# EAGLE design alpha_board (EAGLE 7.4.0)
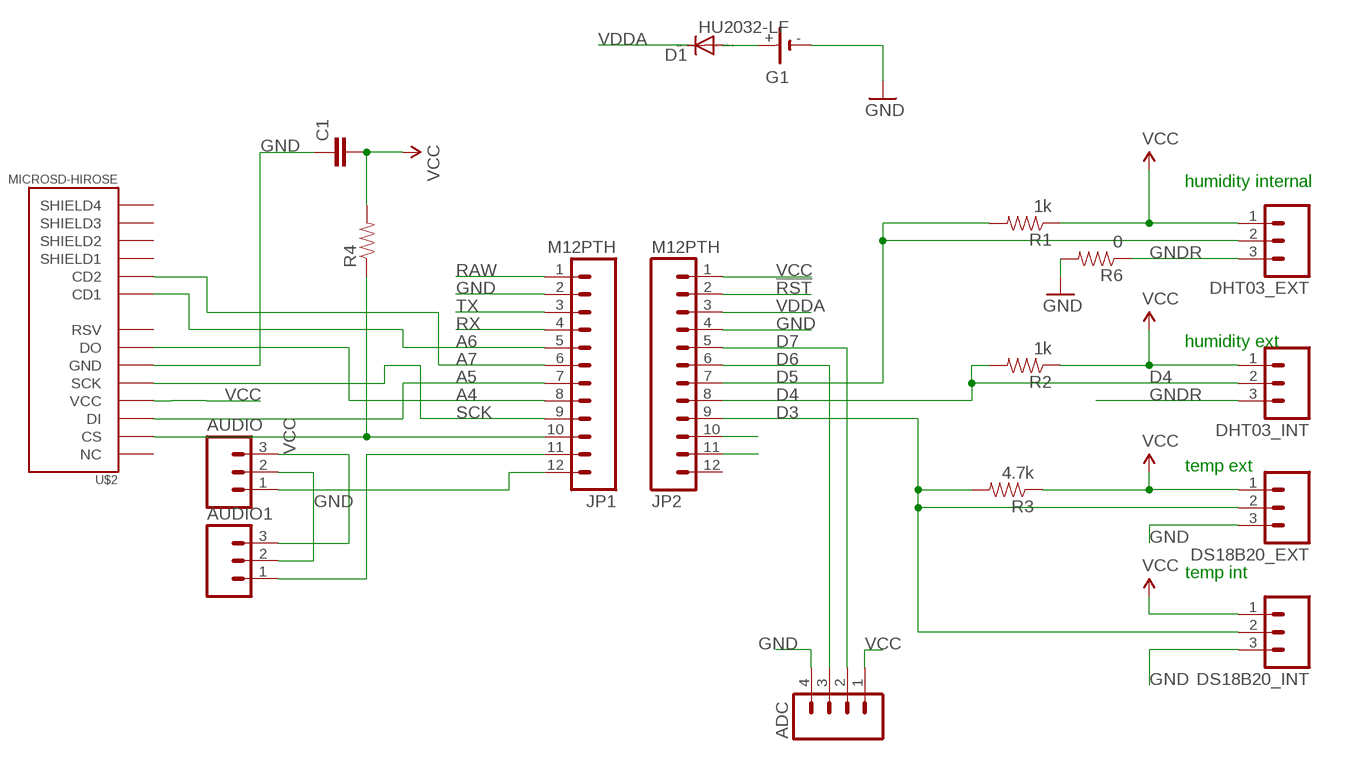
[diagram p0: schematic, sheet 1]

## Parts
ADC  M04LOCK_LONGPADS  [1X04_LOCK_LONGPADS]
AUDIO  M03LOCK  [1X03_LOCK]
AUDIO1  M03LOCK  [1X03_LOCK]
C1  CAP1206  [1206]
D1  DIODE-SOD323-W  [SOD323-W]
DHT03_EXT  M03LOCK  [1X03_LOCK]
DHT03_INT  M03LOCK  [1X03_LOCK]
DS18B20_EXT  M03LOCK  [1X03_LOCK]
DS18B20_INT  M03LOCK  [1X03_LOCK]
G1  HU2032-LF  [HU2032-LF]
JP1  M12PTH  [1X12-SMALL-PADS]
JP2  M12PTH  [1X12-SMALL-PADS]
R1  1k  RESISTOR1206  [1206]
R2  1k  RESISTOR1206  [1206]
R3  4.7k  RESISTOR1206  [1206]
R4  RESISTOR1206  [1206]
R6  0  RESISTOR1206  [1206]
U$2  MICROSD-HIROSE  [MICROSD_HOLDER-HIROSE-DM3AT]

## Nets
!RST: JP2.2
A4: JP1.8 U$2.DAT0(DO)
A5: JP1.7 U$2.CMD(DI)
A6: JP1.5 U$2.CD1
A7: JP1.6 U$2.CD2
D3: DS18B20_EXT.2 DS18B20_INT.2 JP2.9 R3.2
D4: DHT03_INT.2 JP2.8 R2.2
D5: DHT03_EXT.2 JP2.7 R1.2
D6: ADC.3 JP2.6
D7: ADC.2 JP2.5
GND: ADC.4 AUDIO1.2 AUDIO.2 C1.1 DS18B20_EXT.3 DS18B20_INT.3 G1.- JP1.2 JP2.4 R6.2 U$2.VSS(GND)
GNDR: DHT03_EXT.3 DHT03_INT.3 R6.1
N$1: JP1.10 R4.1 U$2.DAT3(CS)
N$2: AUDIO.1 JP1.12
N$3: D1.A G1.+
N$4: JP2.11
N$6: AUDIO1.1 JP1.11
N$7: JP2.10
RAW [vcc]: JP1.1
RX: JP1.4
SCK: JP1.9 U$2.CLK(SCK)
TX: JP1.3
VCC: ADC.1 AUDIO1.3 AUDIO.3 C1.2 DHT03_EXT.1 DHT03_INT.1 DS18B20_EXT.1 DS18B20_INT.1 JP2.1 R1.1 R2.1 R3.1 R4.2 U$2.VDD(VCC)
VDDA: D1.C JP2.3
Unconnected: G1.+@1(+) JP2.12 U$2.BODY1(SHIELD1) U$2.BODY2(SHIELD2) U$2.BODY3(SHIELD3) U$2.BODY4(SHIELD4) U$2.DAT1(RSV) U$2.DAT2(NC)

## Notes on the sheet
- humidity internal
- humidity ext
- temp ext
- temp int

## Library data of the parts
ADC = SparkFun-Connectors:M04: Header 4 Standard 4-pin 0.1" header. Use with straight break away headers (SKU : PRT-00116), right angle break away headers (PRT-00553), swiss pins (PRT-00743), machine pins (PRT-00117), and female headers (PRT-00115). Molex polarized connector foot print use with SKU : PRT-08231 with associated crimp pins and housings. 1MM SMD Version SKU: PRT-10208
AUDIO AUDIO1 DHT03_EXT DHT03_INT DS18B20_EXT DS18B20_INT = SparkFun:M03: Header 3 Standard 3-pin 0.1" header. Use with straight break away headers (SKU : PRT-00116), right angle break away headers (PRT-00553), swiss pins (PRT-00743), machine pins (PRT-00117), and female headers (PRT-00115). Molex polarized connector foot print use with SKU : PRT-08232 with associated crimp pins and housings.
C1 = SparkFun:CAP: Capacitor Standard 0603 ceramic capacitor, and 0.1" leaded capacitor.
D1 = diode:DIODE-: DIODE
G1 = Simplex-Battery:HU2032-LF: Renata HU2032 Li battery holder
JP1 JP2 = Spark:M12: Header 12 Standard 12-pin 0.1" header. Use with straight break away headers (SKU : PRT-00116), right angle break away headers (PRT-00553), swiss pins (PRT-00743), machine pins (PRT-00117), and female headers (PRT-00115).
R1-R4 R6 = SparkFun:RESISTOR: Resistor Basic schematic elements and footprints for 0603, 1206, and PTH resistors.
U$2 = calculator_lib:MICROSD-HIROSE

## Board
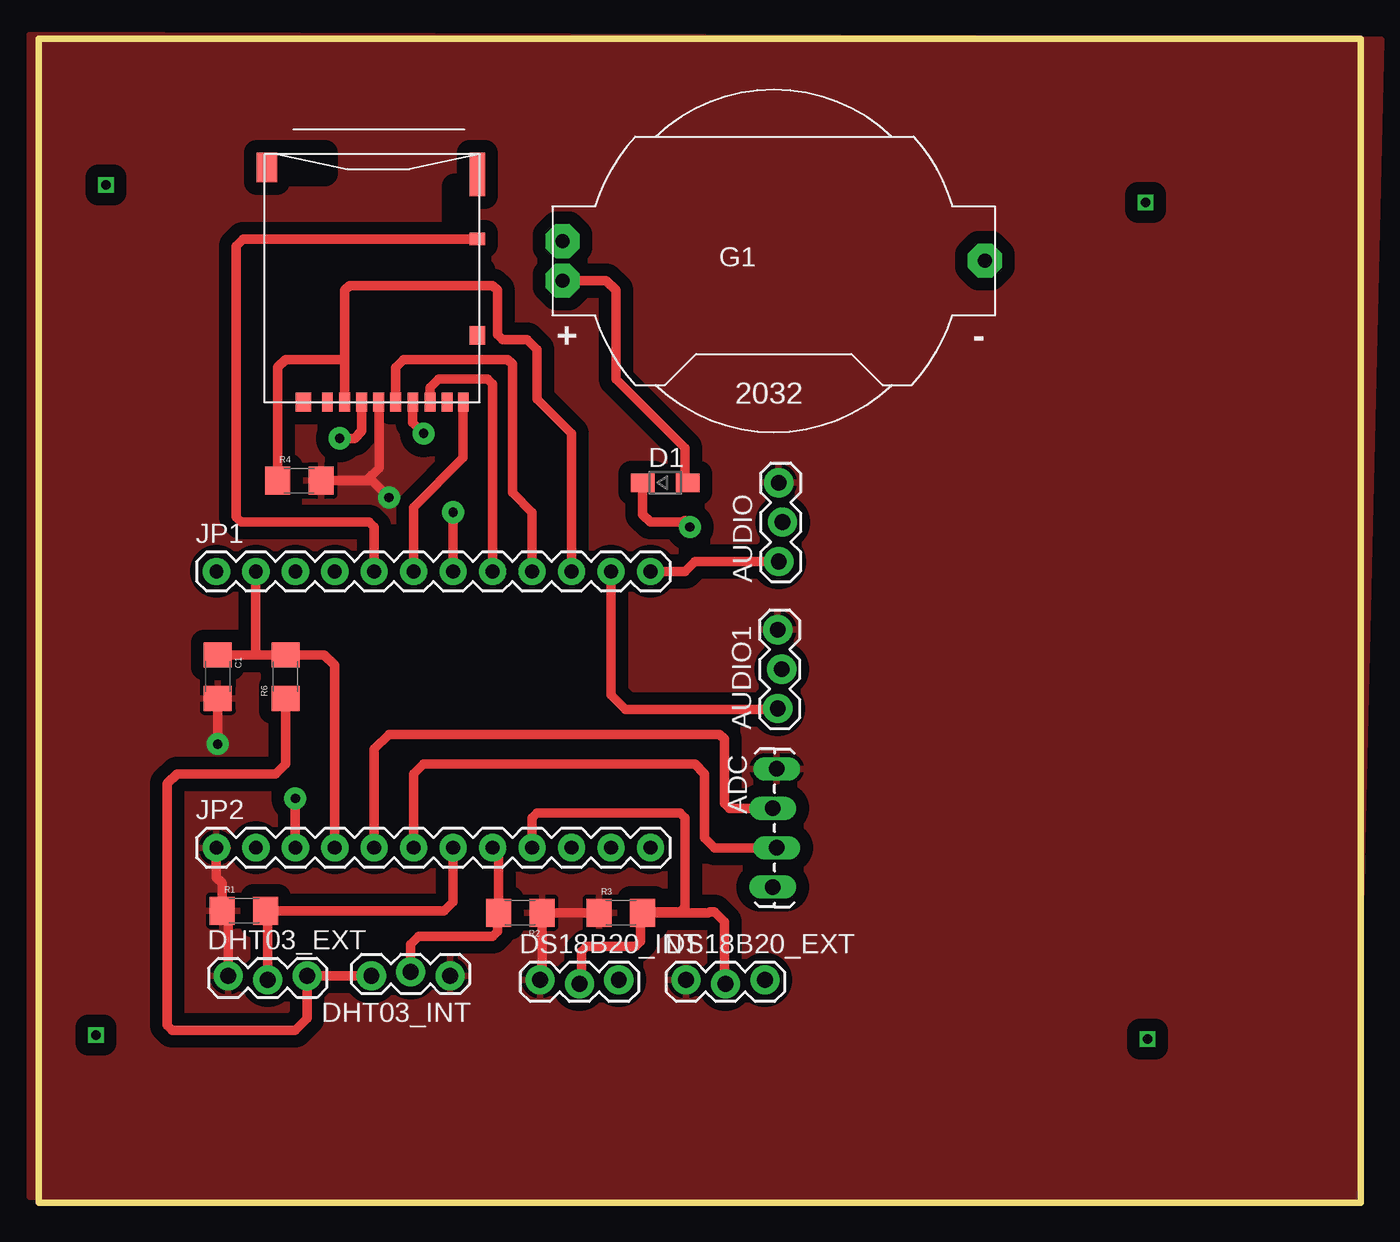
[diagram p1: board, top side]
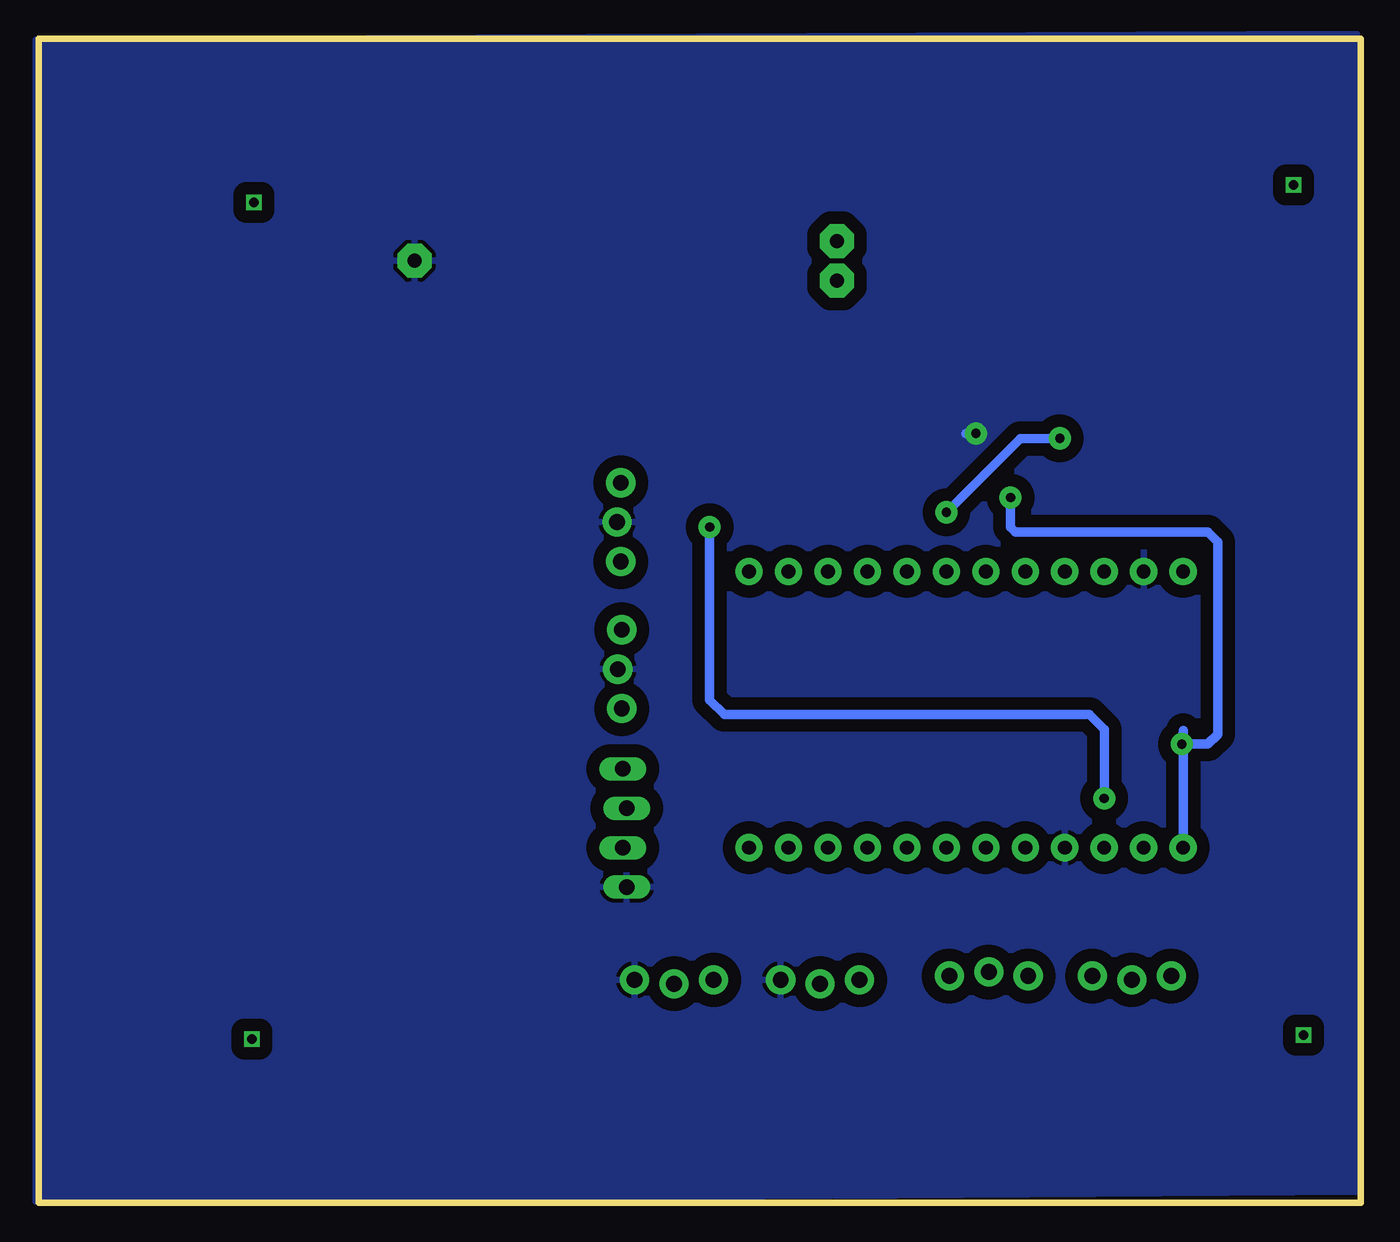
[diagram p2: board, bottom side, seen from below]

Size 85.09 x 74.93 mm. Coordinates in mm from the lower left corner, seen from the top.
Outline: 0,0 0,74.93 85.09,74.93 85.09,0 0,0
Copper layers (1*16): Top 0.035mm / dielectric 1.5mm / Bottom 0.035mm
Design rules "default *": minimum track width 10mil, minimum drill 24mil, track to track 8mil, track to pad 8mil, pad to pad 8mil, via to via 8mil, smd to smd 8mil, copper to edge 0mil, drill to drill 8mil, minimum pad ring 10mil, minimum via ring 8mil, stop-mask expansion 4mil, vias tented up to drill 0mil, thermal gap 10mil

### Footprints (pad centres in the part's own frame; a part is rotated, then mirrored left to right if it is on the bottom)
1X04_LOCK_LONGPADS = drill 1.016 long: 1 0,0; 2 2.54,-0.254; 3 5.08,0; 4 7.62,-0.254
1X03_LOCK = drill 1.016 pad 1.88: 1 0,0.127; 2 2.54,-0.127; 3 5.08,0.127
1206 = smd 1.6 x 1.8: 1 -1.4,0; 2 1.4,0
SOD323-W = smd 1.5 x 1.2: A 1.45,0; C -1.45,0
HU2032-LF = drill 0.9 pad 2.184 octagon: + -13.6,-1.27; +@1 -13.6,1.27; - 13.6,0
1X12-SMALL-PADS = drill 0.889 pad 1.753: 1 0,0; 2 2.54,0; 3 5.08,0; 4 7.62,0; 5 10.16,0; 6 12.7,0; 7 15.24,0; 8 17.78,0; 9 20.32,0; 10 22.86,0; 11 25.4,0; 12 27.94,0
MICROSD_HOLDER-HIROSE-DM3AT = smd 1 x 2.8: BODY1 -6.35,-14.65 | smd 1 x 1.2: BODY2 -6.35,-4.3; BODY4 4.85,0 | smd 1.3 x 1.9: BODY3 7.2,-15.1 | smd 1 x 0.8: CD1 -6.35,-10.5 | smd 0.7 x 1.2: CD2 -5.45,0; CLK -1.1,0; CMD 1.1,0; DAT0 -3.3,0; DAT1 -4.4,0; DAT2 3.3,0; DAT3 2.2,0; VDD 0,0; VSS -2.2,0

### Placement (x,y rotation side)
ADC  47.5,27.94 270 top
AUDIO  47.75,41.28 90 top
AUDIO1  47.69,31.81 90 top
C1  11.51,33.88 270 top
D1  40.32,46.36 0 top
DHT03_EXT  12.19,14.48 0 top
DHT03_INT  26.48,14.73 180 top
DS18B20_EXT  41.66,14.22 0 top
DS18B20_INT  32.26,14.22 0 top
G1  47.31,60.64 0 top
JP1  11.43,40.64 0 top
JP2  11.43,22.86 0 top
R1  13.21,18.8 0 top
R2  30.99,18.67 180 top
R3  37.46,18.67 0 top
R4  16.76,46.48 0 top
R6  15.88,33.88 90 top
U$2  21.88,51.54 180 top

### Tracks (layer width: path | path; a pad name or v marks a point on that pad's centre or on a via)
A4
  Top 0.61: U$2.DAT0 25.17,52.48 25.72,53.02 28.89,53.02 29.21,52.71 JP1.8
A5  (via drill 0.6 pad 1.42)
  Top 0.61: U$2.CMD 20.77,49.67 20.32,49.21 v19.37,49.21 | v26.67,44.45 JP1.7
  Bottom 0.61: v19.37,49.21 21.91,49.21 v26.67,44.45
A6
  Top 0.61: U$2.CD1 13.15,62.04 12.7,61.6 12.7,44.13 13.02,43.82 21.27,43.82 21.59,43.5 JP1.5
A7
  Top 0.61: U$2.CD2 27.33,47.96 24.13,44.77 JP1.6
D3
  Top 0.61: JP2.9 31.75,24.77 32.07,25.08 41.27,25.08 41.59,24.77 41.59,19.05 41.27,18.73 38.93,18.73 R3.2 | R3.2 43.12,18.67 43.18,18.73 43.5,18.73 44.13,18.1 44.13,14.16 DS18B20_EXT.2 | DS18B20_INT.2 34.92,14.1 34.92,16.19 35.24,16.51 38.42,16.51 38.73,16.83 38.73,18.54 R3.2
D4
  Top 0.61: R2.2 29.59,19.37 | 29.59,19.37 29.59,22.48 JP2.8 | DHT03_INT.2 23.94,16.64 24.45,17.14 29.21,17.14 29.53,17.46 29.53,19.31 29.59,19.37
D5
  Top 0.61: JP2.7 26.67,19.37 26.1,18.8 R1.2 14.73,18.67 DHT03_EXT.2
D6
  Top 0.61: ADC.3 43.5,22.86 42.86,23.5 42.86,27.62 42.23,28.26 24.77,28.26 24.13,27.62 24.13,26.35 24.13,25.72 JP2.6
D7
  Top 0.61: JP2.5 21.59,29.21 22.54,30.16 43.81,30.16 44.13,29.84 44.13,25.72 44.45,25.4 ADC.2
GND  (via drill 0.6 pad 1.42)
  Top 0.61: U$2.VSS 24.08,50.22 v24.77,49.53 | C1.1 13.97,35.28 | 13.97,35.28 R6.2 18.38,35.28 19.05,34.61 JP2.4 | JP1.2 13.97,35.28
  Bottom 0.61: v24.77,49.53 25.4,49.53
  pour Bottom (isolate 0.813): 0.25,75.25 85.28,74.87 85.28,0.06 0,0.7
GNDR
  Top 0.61: R6.1 15.88,28.26 15.24,27.62 8.89,27.62 8.25,26.99 8.25,11.43 8.57,11.11 16.51,11.11 17.27,11.87 DHT03_EXT.3 DHT03_INT.3
N$1
  Top 0.61: JP1.10 34.29,49.53 32.07,51.75 32.07,54.93 31.43,55.56 29.84,55.56 29.53,55.88 29.53,58.74 29.21,59.05 20,59.05 19.69,58.74 19.69,54.29 | U$2.DAT3 19.69,51.55 19.69,54.29 | 19.69,54.29 15.88,54.29 15.36,53.78 R4.1
N$2
  Top 0.61: JP1.12 41.59,40.64 42.23,41.28 AUDIO.1
N$3
  Top 0.61: D1.A 41.59,46.54 41.59,48.58 37.15,53.02 37.15,58.74 36.51,59.37 G1.+
N$6
  Top 0.61: JP1.11 36.83,32.7 37.78,31.75 46.04,31.75 | 46.67,31.75 46.04,31.75 | 46.04,31.75 AUDIO1.1
N$14  (via drill 0.6)
  other vias: 4.32,65.53
N$15  (via drill 0.6)
  other vias: 71.25,64.39
N$16  (via drill 0.6)
  other vias: 71.37,10.54
N$17  (via drill 0.6)
  other vias: 3.68,10.79
SCK
  Top 0.61: U$2.CLK 22.98,53.77 23.49,54.29 30.16,54.29 30.48,53.98 30.48,45.72 31.75,44.45 JP1.9
VCC  (via drill 0.6 pad 1.42)
  Top 0.61: U$2.VDD 21.91,51.51 21.91,47.31 21.08,46.48 R4.2 21.46,46.48 v22.54,45.4 | C1.2 v11.51,29.53 11.51,29.29 | R3.1 R2.1 32.39,14.48 DS18B20_INT.1 | DHT03_EXT.1 12.19,18.41 R1.1 11.81,20.58 11.43,20.95 11.43,22.22 12.07,22.86 JP2.1
  Bottom 0.61: v22.54,45.4 22.54,43.5 22.23,43.18 9.84,43.18 9.21,42.55 9.21,30.16 9.84,29.53 v11.51,29.53 11.43,30.4 JP2.1
  pour Top (isolate 0.813): -0.57,75.18 86.42,74.87 84.65,0.06 -0.57,0.38
VDDA  (via drill 0.6 pad 1.42)
  Top 0.61: D1.C 38.87,44.31 39.37,43.82 41.59,43.82 | v16.51,26.04 JP2.3
  Top 0.813: 41.59,43.82 v41.91,43.5
  Bottom 0.61: v41.91,43.5 41.91,32.38 40.96,31.43 17.46,31.43 16.51,30.48 v16.51,26.04